# EAGLE schematic Arduino_Smart_Home_Lock (EAGLE 9.6.2)
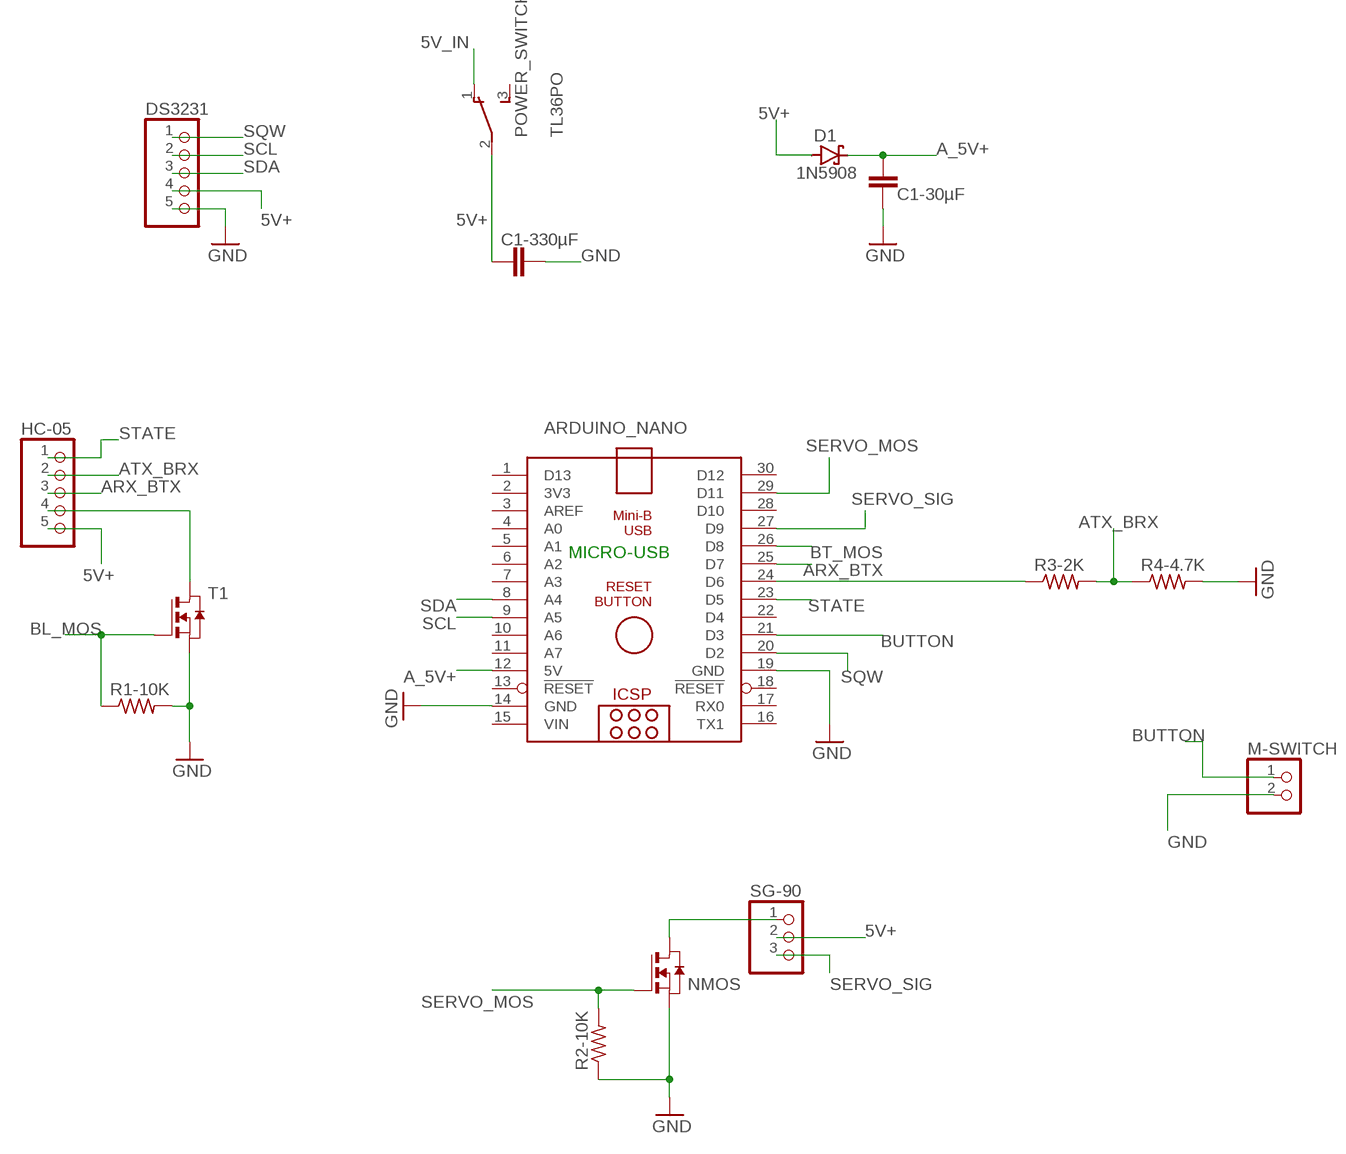
[diagram p0: schematic, sheet 1]

## Parts
ARDUINO_NANO  ARDUINO_NANO  [ARDUINO_NANO]
C1-30µF  C2.5/5  [C2.5-5]
C1-330µF  C2.5/5  [C2.5-5]
D1  1N5908  [C4111-15]
DS3231  PINHD-1X55X2MM  [1_05X2MM]
HC-05  PINHD-1X55X2MM  [1_05X2MM]
M-SWITCH  PINHD-1X2  [1X02]
NMOS  NMOSE3L  [E3LINE]
POWER_SWITCH  TL36PO  [TL3XPO]
R1-10K  R-US_0207/12  [0207/12]
R2-10K  R-US_0207/12  [0207/12]
R3-2K  R-US_0207/12  [0207/12]
R4-4.7K  R-US_0207/12  [0207/12]
SG-90  PINHD-1X3  [1X03]
T1  NMOSE3L  [E3LINE]

## Nets
5V+ [power]: C1-330µF.1 D1.A DS3231.4 HC-05.5 POWER_SWITCH.2(P) SG-90.2
5V_IN [power]: POWER_SWITCH.1(O)
A_5V+: ARDUINO_NANO.12(5V) C1-30µF.1 D1.C
ARX_BTX: ARDUINO_NANO.25(D7) HC-05.3
ATX_BRX: HC-05.2 R3-2K.2 R4-4.7K.1
BL_MOS: R1-10K.1 T1.2(G)
BT_MOS: ARDUINO_NANO.26(D8)
BUTTON: ARDUINO_NANO.21(D3) M-SWITCH.1
GND [ground]: ARDUINO_NANO.14(GND) ARDUINO_NANO.19(GND) C1-30µF.2 C1-330µF.2 DS3231.5 M-SWITCH.2 NMOS.3(S) R1-10K.2 R2-10K.1 R4-4.7K.2 T1.3(S)
N$1: ARDUINO_NANO.24(D6) R3-2K.1
N$2: NMOS.1(D) SG-90.1
N$3: HC-05.4 T1.1(D)
SCL: ARDUINO_NANO.9(A5) DS3231.2
SDA: ARDUINO_NANO.8(A4) DS3231.3
SERVO_MOS: ARDUINO_NANO.29(D11) NMOS.2(G) R2-10K.2
SERVO_SIG: ARDUINO_NANO.27(D9) SG-90.3
SQW: ARDUINO_NANO.20(D2) DS3231.1
STATE: ARDUINO_NANO.23(D5) HC-05.1
Unconnected: ARDUINO_NANO.1(D13) ARDUINO_NANO.2(3V3) ARDUINO_NANO.3(AREF) ARDUINO_NANO.4(A0) ARDUINO_NANO.5(A1) ARDUINO_NANO.6(A2) ARDUINO_NANO.7(A3) ARDUINO_NANO.10(A6) ARDUINO_NANO.11(A7) ARDUINO_NANO.13(!RESET) ARDUINO_NANO.16(TX1) ARDUINO_NANO.17(RX0) ARDUINO_NANO.18(!RESET) ARDUINO_NANO.22(D4) ARDUINO_NANO.28(D10) ARDUINO_NANO.30(D12) POWER_SWITCH.3(S)

## Notes on the sheet
- MICRO-USB

## Power pins joined to a net without a drawn wire
VIN: ARDUINO_NANO.15(VIN)

## Library data of the parts
ARDUINO_NANO = ArduinoNanoV30:ARDUINO_NANO: Arduino Nano V3.0 Overview: The Arduino Nano is a small, complete, and breadboard-friendly board based on the ATmega328 (Arduino Nano 3.x) or ATmega168 (Arduino Nano 2.x). It has more or less the same functionality of the Arduino Duemilanove, but in a different package. It lacks only a DC power jack, and works with a Mini-B USB cable instead of a standard one. The Nano was designed and is being produced by Gravitech. Specifications: Microcontroller Atmel ATmega168 or ATmega328 Operating Voltage (logic level) 5 V Input Voltage (recommended) 7-12 V Input Voltage (limits) 6-20 V Digital I/O Pins 14 (of which 6 provide PWM output) Analog Input Pins 8 DC Current per I/O Pin 40 mA Flash Memory 16 KB (ATmega168) or 32 KB (ATmega328) of which 2 KB used by bootloader SRAM 1 KB (ATmega168) or 2 KB (ATmega328) EEPROM 512 bytes (ATmega168) or 1 KB (ATmega328) Clock Speed 16 MHz Dimensions 0.73" x 1.70" Length 45 mm Width 18 mm Weigth 5 g Power: The Arduino Nano can be powered via the Mini-B USB connection, 6-20V unregulated external power supply (pin 30), or 5V regulated external power supply (pin 27). The power source is automatically selected to the highest voltage source. Memory: The ATmega168 has 16 KB of flash memory for storing code (of which 2 KB is used for the bootloader); the ATmega328 has 32 KB, (also with 2 KB used for the bootloader). The ATmega168 has 1 KB of SRAM and 512 bytes of EEPROM (which can be read and written with the EEPROM library); the ATmega328 has 2 KB of SRAM and 1 KB of EEPROM. Input and Output: Each of the 14 digital pins on the Nano can be used as an input or output, using pinMode(), digitalWrite(), and digitalRead() functions. They operate at 5 volts. Each pin can provide or receive a maximum of 40 mA and has an internal pull-up resistor (disconnected by default) of 20-50 kOhms. In addition, some pins have specialized functions. Visit Arduino - ArduinoBoardNano <https://www.arduino.cc/en/Main/ArduinoBoardNano>
C1-30µF C1-330µF = capacitor-wima:C: CAPACITOR naming: grid - package width
D1 = diode:1N5908: DIODE schottky
DS3231 HC-05 = pinhead:PINHD-1X5: PIN HEADER
M-SWITCH = pinhead:PINHD-1X2: PIN HEADER
NMOS T1 = zetex:NMOSE3L: MOS FET; OC_FARNELL: unknown; OC_NEWARK: unknown
POWER_SWITCH = switch:TL36PO: TINY SWITCH ON - ON Source: http://www2.produktinfo.conrad.com/datenblaetter/700000-724999/705152-da-01-de-Subminiaturschalter_TL_36YO.pdf
R1-10K R2-10K R3-2K R4-4.7K = rcl:R-US_: RESISTOR, American symbol; SPICEPREFIX: R
SG-90 = pinhead:PINHD-1X3: PIN HEADER